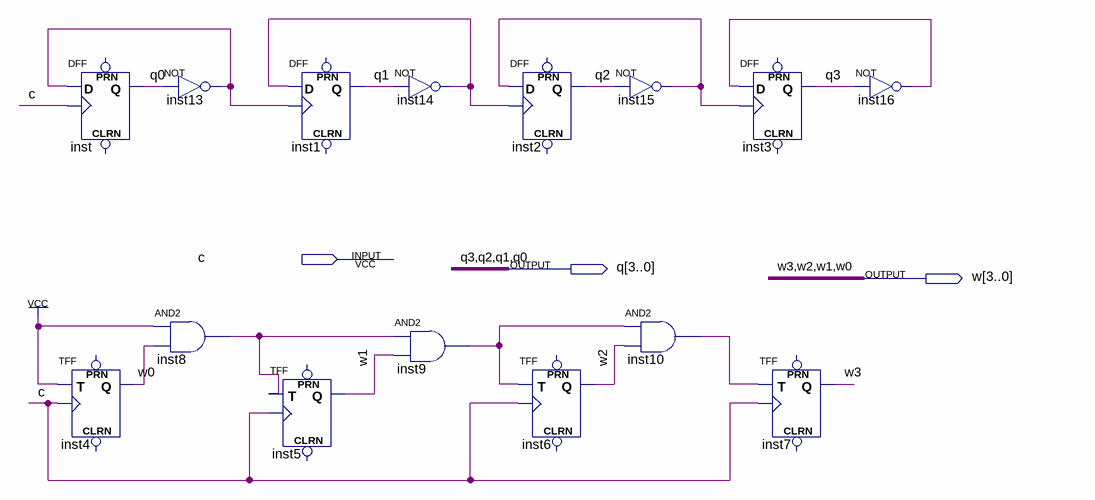
[diagram p0: schematic sheet]
// Quartus schematic s71.bdf as structural Verilog: 15 symbols, 3 pins
module s71 (
  input  c,
  output [3:0] q,
  output [3:0] w
);

  wire inst8_out, inst9_out, inst10_out, inst13_out, inst14_out, inst15_out, inst16_out;

  DFF inst (.CLK(c), .D(inst13_out), .Q(q[0]));  // open: CLRN, PRN
  TFF inst4 (.T(1'b1), .CLK(c), .Q(w[0]));  // open: PRN, CLRN
  not inst13 (inst13_out, q[0]);
  and inst8 (inst8_out, 1'b1, w[0]);
  DFF inst1 (.CLK(inst13_out), .D(inst14_out), .Q(q[1]));  // open: CLRN, PRN
  TFF inst5 (.T(inst8_out), .CLK(c), .Q(w[1]));  // open: PRN, CLRN
  not inst14 (inst14_out, q[1]);
  and inst9 (inst9_out, inst8_out, w[1]);
  DFF inst2 (.CLK(inst14_out), .D(inst15_out), .Q(q[2]));  // open: CLRN, PRN
  TFF inst6 (.T(inst9_out), .CLK(c), .Q(w[2]));  // open: PRN, CLRN
  not inst15 (inst15_out, q[2]);
  and inst10 (inst10_out, inst9_out, w[2]);
  DFF inst3 (.CLK(inst15_out), .D(inst16_out), .Q(q[3]));  // open: CLRN, PRN
  TFF inst7 (.T(inst10_out), .CLK(c), .Q(w[3]));  // open: PRN, CLRN
  not inst16 (inst16_out, q[3]);
endmodule
